# EasyEDA Pro project LedKeychainATtiny2313.eprj

# Schematic Schematic1
Board Name: Board1; Create Date: 2025-04-13; Page Name: P1; Project Name: LedKeychainATtiny2313; Schematic Name: Schematic1; Update Date: 2025-08-21; Company: m039; Drawn: Dmitry Mozgin; Page Size: A4; Version: V1.0
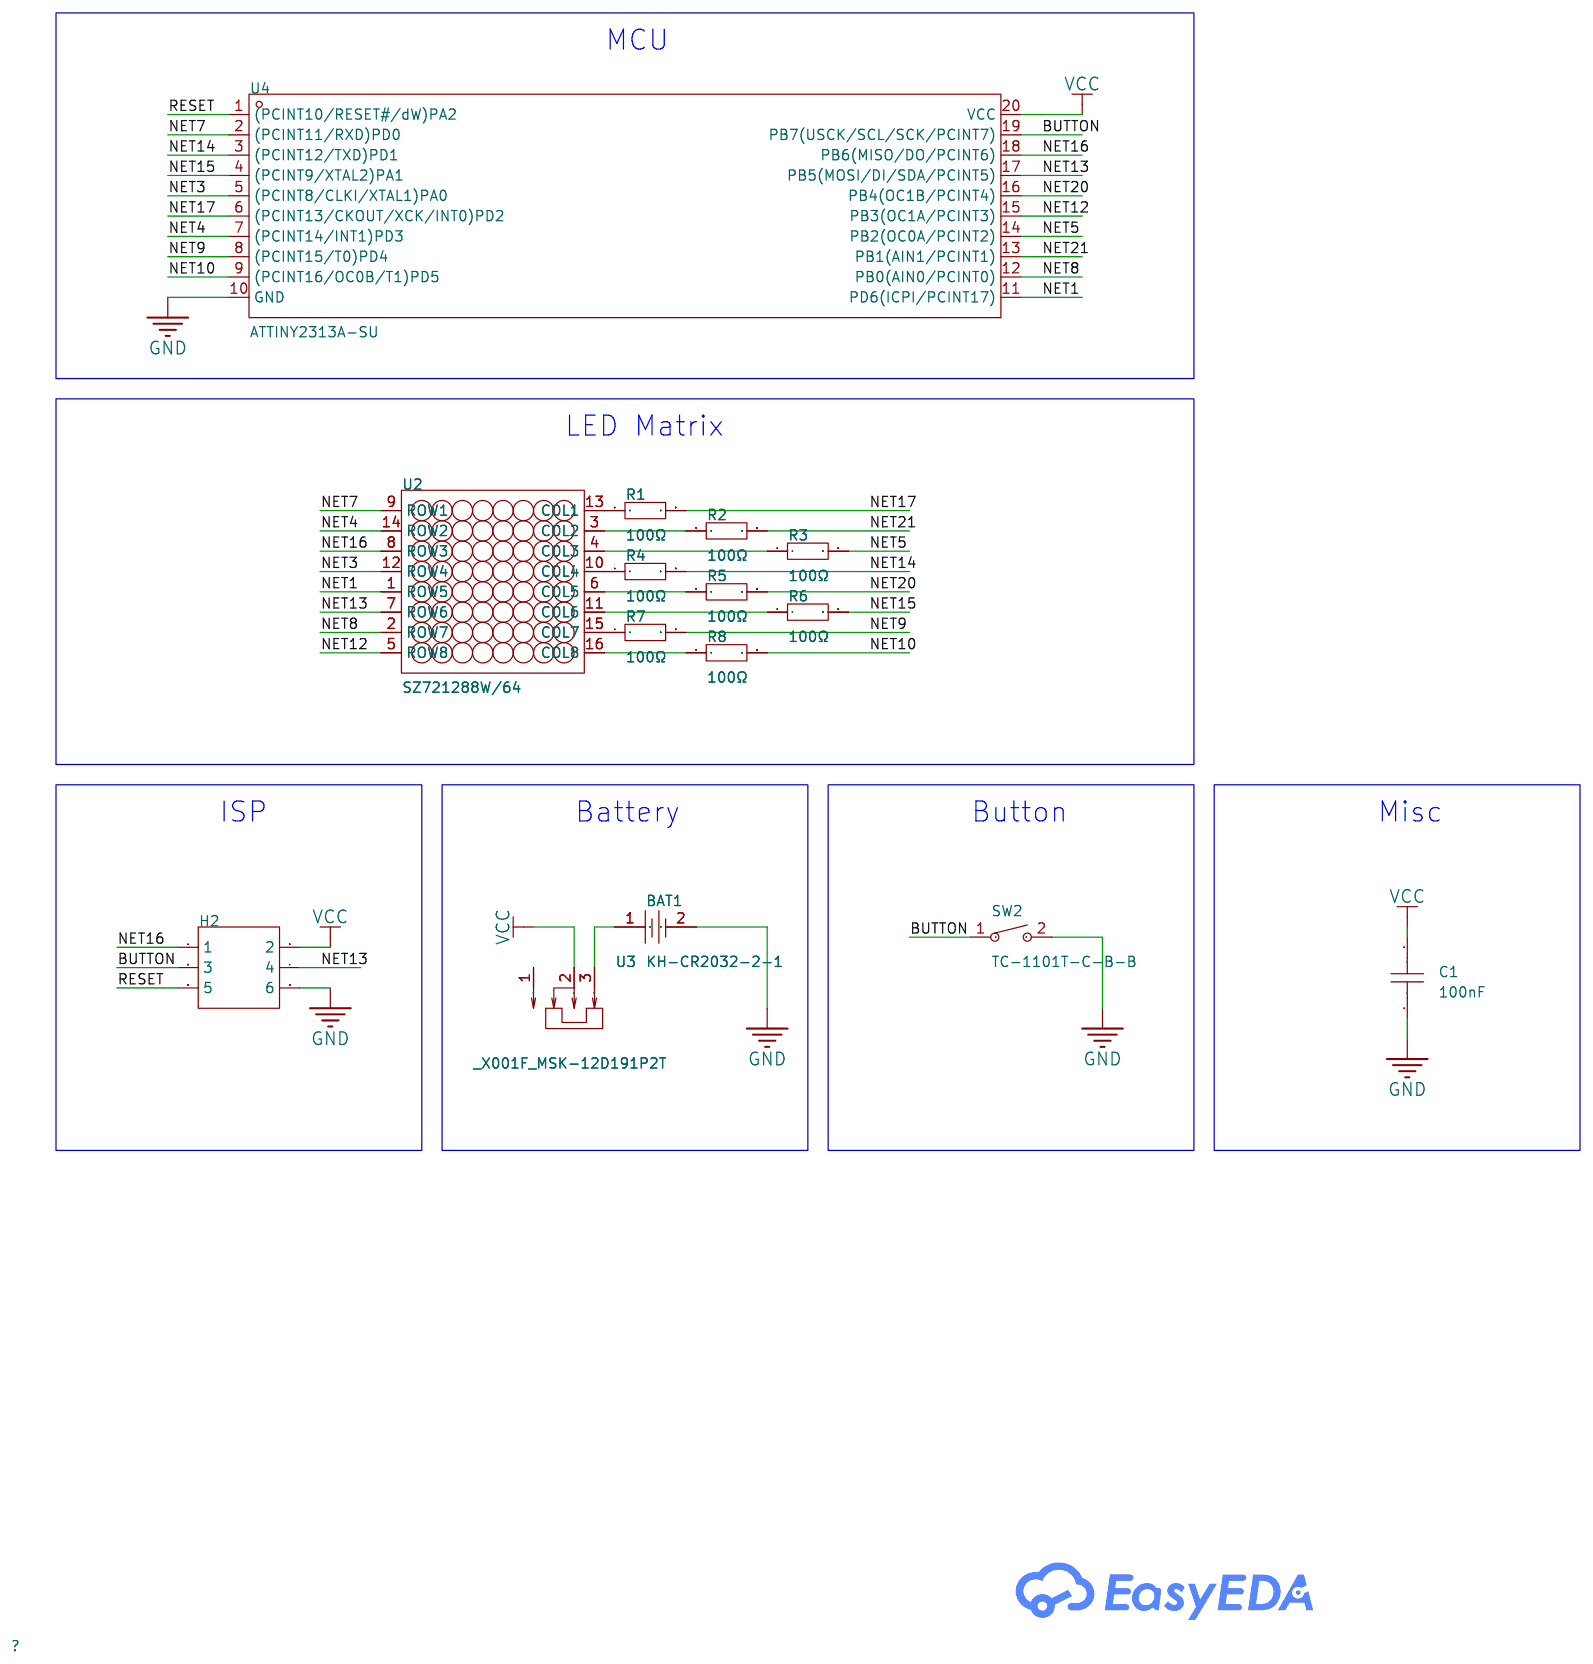
[diagram p0: schematic sheet]

## Parts
BAT1  KH-CR2032-2-1  [BAT-TH_KH-CR2032-2-1]
C1  100nF  [C0805]
H2  -  [HDR-TH_6P-P2.54-V-R2-C3-S2.54_A2541WV-2X3P]
R1  100Ω  [R0805]
R2  100Ω  [R0805]
R3  100Ω  [R0805]
R4  100Ω  [R0805]
R5  100Ω  [R0805]
R6  100Ω  [R0805]
R7  100Ω  [R0805]
R8  100Ω  [R0805]
SW2  TC-1101T-C-B-B  [KEY-TH_2P-L6.0-W3.5-P6.50]
U2  SZ721288W/64  [LED-SEG-TH_SZ421288N-64]
U3  _X001F_MSK-12D191P2T  [SW-TH_MSK-12D191P2T]
U4  ATTINY2313A-SU  [SOIC-20_L13.0-W7.6-P1.27-LS10.3-BL]

## Library data of the parts
BAT1 = KH-CR2032-2-1: Supplier Part: C5365915; Manufacturer: kinghelm(金航标); JLCPCB Part Class: Extended Part; Datasheet: https://atta.szlcsc.com/upload/public/pdf/source/20230301/F3ED62C53898C1F99BC47B7A2E148BA2.pdf; Supplier: LCSC
C1 = CAP_0805: Supplier Footprint: 0805
H2 = HDR-M_2.54_2x3: Supplier Footprint: Through
R1-R8 = 0805W8F1002T5E: LCSC Part Name: 10kΩ ±1% 125mW 厚膜电阻; Supplier Part: C17414; Manufacturer: UNI-ROYAL(厚声); Supplier Footprint: 0805; JLCPCB Part Class: Basic Part; Datasheet: https://atta.szlcsc.com/upload/public/pdf/source/20200306/C422600_1E6D84923E4A46A82E41ADD87F860B5C.pdf; Supplier: LCSC; Type: Thick Film Resistors; Tolerance: ±1%; Temperature Coefficient: ±100ppm/℃; Operating Temperature Range: -55℃~+155℃
SW2 = TC-1101T-C-B-B: LCSC Part Name: 6*3.5*5mm 直插 轻触开关; Supplier Part: C500068; Manufacturer: XKB Connectivity(中国星坤); Supplier Footprint: 插件; JLCPCB Part Class: Extended Part; Datasheet: https://atta.szlcsc.com/upload/public/pdf/source/20211011/B69A8CD93B4DADD1FF98516D35420DE2.pdf; Supplier: LCSC; Circuit: SPST; Actuator Style: Rectangle button; Operating Force: 260gf; Mounting Style: Straight; Switch Length: 6mm; Switch Width: 3.5mm; Switch Height: 5mm; Strike Gundam: 不带; Contact Current: 50mA; Voltage Rating (DC): 12V; Actuator/Cap Color: Black; With Lamp: No; Pin Style: PCPin; Mechanical Life: 5万次; Operating Temperature: -20℃~+70℃
U2 = SZ721288W/64: LCSC Part Name: 8x8位共阴极白色LED点阵; Supplier Part: C2980924; Manufacturer: ARKLED(方舟); Supplier Footprint: 插件; JLCPCB Part Class: Extended Part; Datasheet: https://atta.szlcsc.com/upload/public/pdf/source/20220310/02C92D6EC4802147600AB7D5BBA1ACF2.pdf; Supplier: LCSC; Dot Matrix Number: 8x8; Emitting Color: White; Polarity: Common Cathode
U3 = MSK-12D19: Supplier: LCSC; Supplier Part: C9900016029; Manufacturer: null; Manufacturer Part: _x001F_MSK-12D191P2T; JLCPCB Part Class: Extended Part
U4 = ATTINY2313A-SU: Supplier Part: C424094; Manufacturer: MICROCHIP(美国微芯); Supplier Footprint: SOIC-20-300mil; JLCPCB Part Class: Extended Part; Datasheet: https://item.szlcsc.com/datasheet/ATTINY2313A-SU/417117.html; Supplier: LCSC; CPU Core: AVR; CPU Maximum Speed: 20MHz; Program Storage Size: 1KB; Program Memory Type: FLASH; Number of I/O: 18; Voltage - Supply: 1.8V~5.5V

## Nets
GND: BAT1.2 C1.1 H2.6 SW2.2 U4.10(GND)
VCC: C1.2 H2.2 U3.2 U4.20(VCC)
BUTTON: H2.3 SW2.1 U4.19(PB7(USCK/SCL/SCK/PCINT7))
NET1: U2.1(ROW5) U4.11(PD6(ICPI/PCINT17))
NET3: U2.12(ROW4) U4.5((PCINT8/CLKI/XTAL1)PA0)
NET4: U2.14(ROW2) U4.7((PCINT14/INT1)PD3)
NET5: R3.2 U4.14(PB2(OC0A/PCINT2))
NET7: U2.9(ROW1) U4.2((PCINT11/RXD)PD0)
NET8: U2.2(ROW7) U4.12(PB0(AIN0/PCINT0))
NET9: R7.2 U4.8((PCINT15/T0)PD4)
NET10: R8.2 U4.9((PCINT16/OC0B/T1)PD5)
NET12: U2.5(ROW8) U4.15(PB3(OC1A/PCINT3))
NET13: H2.4 U2.7(ROW6) U4.17(PB5(MOSI/DI/SDA/PCINT5))
NET14: R4.2 U4.3((PCINT12/TXD)PD1)
NET15: R6.2 U4.4((PCINT9/XTAL2)PA1)
NET16: H2.1 U2.8(ROW3) U4.18(PB6(MISO/DO/PCINT6))
NET17: R1.2 U4.6((PCINT13/CKOUT/XCK/INT0)PD2)
NET20: R5.2 U4.16(PB4(OC1B/PCINT4))
NET21: R2.2 U4.13(PB1(AIN1/PCINT1))
RESET: H2.5 U4.1((PCINT10/RESET#/dW)PA2)
$1N1721: R2.1 U2.3(COL2)
$1N1762: R3.1 U2.4(COL3)
$1N1803: R4.1 U2.10(COL4)
$1N1844: R5.1 U2.6(COL5)
$1N1883: R6.1 U2.11(COL6)
$1N1963: R8.1 U2.16(COL8)
$1N1971: R1.1 U2.13(COL1)
$1N1973: R7.1 U2.15(COL7)
$1N4267: BAT1.1 U3.3

Not connected (* = marked no-connect by the designer): U3 1

## Notes on the sheet
- MCU
- LED Matrix
- ISP
- Battery
- Button
- Misc

# Board PCB1
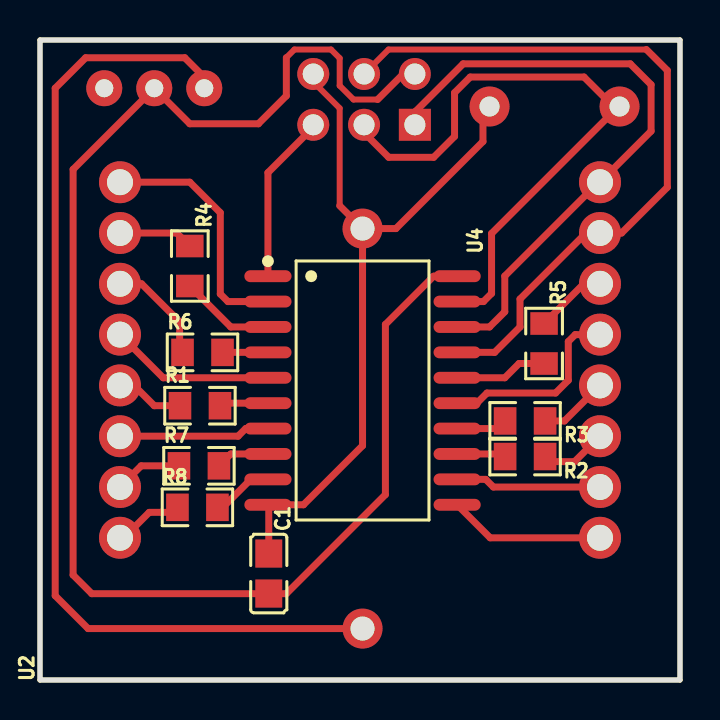
[diagram p1: board, top side]
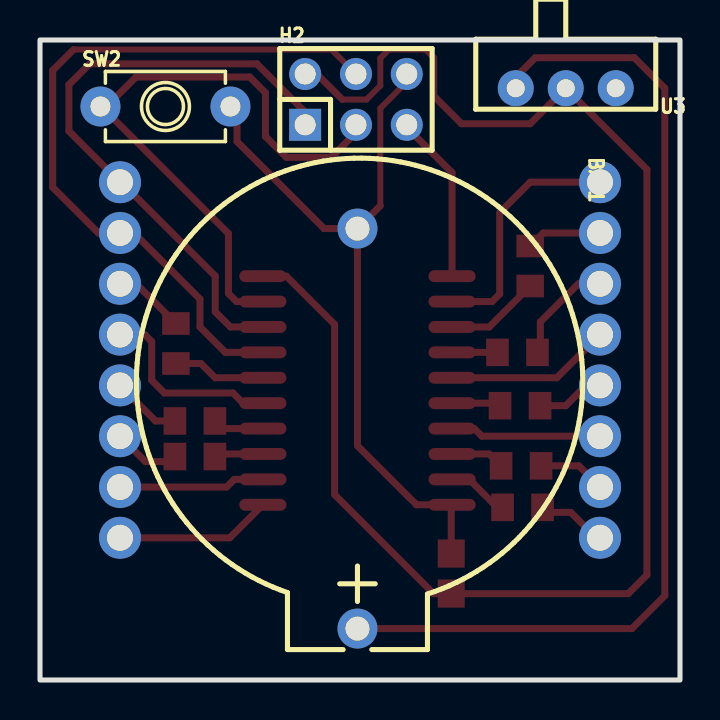
[diagram p2: board, bottom side, seen from below]

Outline 32 x 32 mm; copper layers: Top Layer, Bottom Layer. Coordinates in mm from the lower left corner of the outline.
Outline path: rectangle 0,32 32,0
Stack: Top Layer 0.035mm / Dielectric1 1.51mm FR4 er 4.5 / Bottom Layer 0.035mm

## Design rules (mm)
template: Custom Config
spacing copperThickness1oz (default): track to track 0.102, other pairs 0.152 to 0.3
spacing copperThickness2oz: track to track 0.203, other pairs 0.152 to 0.3
track width copperThickness1oz (default): min 0.127, default 0.35, max 2.54
track width copperThickness2oz: min 0.203, default 0.254, max 2.54
differential pair differentialPair (default): width min 0.127, default 0.254, max 2.54; gap min 0.152, default 0.152
via viaSize (default): diameter min 0.5, default 0.61, max 10; hole min 0.3, default 0.305, max 6.3

## Placement (name value [footprint] x y rotation side)
BAT1  KH-CR2032-2-1  [BAT-TH_KH-CR2032-2-1]  16.13 12.57 270 bottom
C1  100nF  [C0805]  11.44 5.32 270 top
H2  -  [HDR-TH_6P-P2.54-V-R2-C3-S2.54_A2541WV-2X3P]  16.2 29.03 180 bottom
R1  100Ω  [R0805]  8 13.71 0 top
R2  100Ω  [R0805]  24.25 11.17 180 top
R3  100Ω  [R0805]  24.25 12.95 180 top
R4  100Ω  [R0805]  7.49 20.7 270 top
R5  100Ω  [R0805]  25.2 16.82 270 top
R6  100Ω  [R0805]  8.13 16.38 0 top
R7  100Ω  [R0805]  7.95 10.71 0 top
R8  100Ω  [R0805]  7.87 8.63 0 top
SW2  TC-1101T-C-B-B  [KEY-TH_2P-L6.0-W3.5-P6.50]  25.73 28.67 180 bottom
U2  SZ721288W/64  [LED-SEG-TH_SZ421288N-64]  16 16 90 top
U3  _X001F_MSK-12D191P2T  [SW-TH_MSK-12D191P2T]  5.71 29.59 0 bottom
U4  ATTINY2313A-SU  [SOIC-20_L13.0-W7.6-P1.27-LS10.3-BL]  16.13 14.48 270 top

## Footprints (pads in the part's own frame, mm; a bottom-side part is the same pattern mirrored in y, then rotated)
BAT-TH_KH-CR2032-2-1
  round 2 hole 1.2x0.9: 1(10,0) 2(-10,0)
C0805
  rect 1.41x1.35 smd: 1(-1,0) 2(1,0)
HDR-TH_6P-P2.54-V-R2-C3-S2.54_A2541WV-2X3P
  rect 1.6x1.6 hole 1.05x0.8: 1(-2.54,-1.27)
  round 1.6 hole 1.05x0.8: 2(-2.54,1.27) 3(0,-1.27) 4(0,1.27) 5(2.54,-1.27) 6(2.54,1.27)
KEY-TH_2P-L6.0-W3.5-P6.50
  round 2 hole 1: 1(-3.25,0) 2(3.25,0)
LED-SEG-TH_SZ421288N-64
  round 2.1 hole 1.3: 1(-8.89,-12) 2(-6.35,-12) 3(-3.81,-12) 4(-1.27,-12) 5(1.27,-12) 6(3.81,-12) 7(6.35,-12) 8(8.89,-12) 9(8.89,12) 10(6.35,12) 11(3.81,12) 12(1.27,12) 13(-1.27,12) 14(-3.81,12) 15(-6.35,12) 16(-8.89,12)
R0805
  rect 1.133x1.377 smd: 1(-1,0) 2(1,0)
SOIC-20_L13.0-W7.6-P1.27-LS10.3-BL
  oval 0.595x2.36 smd: 1(-5.715,-4.73) 2(-4.445,-4.73) 3(-3.175,-4.73) 4(-1.905,-4.73) 5(-0.635,-4.73) 6(0.635,-4.73) 7(1.905,-4.73) 8(3.175,-4.73) 9(4.445,-4.73) 10(5.715,-4.73) 11(5.715,4.73) 12(4.445,4.73) 13(3.175,4.73) 14(1.905,4.73) 15(0.635,4.73) 16(-0.635,4.73) 17(-1.905,4.73) 18(-3.175,4.73) 19(-4.445,4.73) 20(-5.715,4.73)
SW-TH_MSK-12D191P2T
  round 1.8 hole 0.9x0.8: 1(-2.5,0) 2(0,0) 3(2.5,0)

## Nets
As in the schematic.

Pads without a net: U3 1

## Routing (per net, layer and track width the routed paths; a pad name or vN(x,y) marks a point on that pad's centre or on a via; arc(x,y) is an arc through that point)
GND: length 38
  Top Layer w0.3: 13.66,29.91 14.98,28.59 14.98,23.71
  Top Layer w0.35: BAT1.2 14.98,23.71 ; BAT1.2 16.13,11.71 13.17,8.76 U4.10 11.44,8.72 C1.1 ; BAT1.2 17.8,22.57 22.15,26.92 22.15,28.5 22.57,28.92 ; 13.66,29.91 H2.6
VCC: length 76
  Top Layer w0.3: 16.88,29.02 15.68,29.02 14.98,29.72 14.98,31.09 14.55,31.53 12.72,31.53 12.32,31.12
  Top Layer w0.35: U4.20 19.68,20.19 17.27,17.78 17.27,9.27 12.32,4.32 2.59,4.32 1.66,5.25 1.66,25.53 U3.2 7.49,27.81 10.92,27.81 12.32,29.21 12.32,31.12 ; 18.79,30.35 18.21,30.35 16.88,29.02
BUTTON: length 30.6
  Top Layer w0.35: H2.3 16.2,27.37 17.44,26.13 19.68,26.13 20.73,27.18 20.73,29.36 21.51,30.15 27.2,30.15 28.55,28.79 28.55,28.3 22.58,22.32 22.58,19.33 22.17,18.92 U4.19
NET1: length 7.8
  Top Layer w0.35: U4.11 22.51,7.11 U2.1
NET3: length 8.3
  Top Layer w0.35: U2.12 6.16,15.11 U4.5
NET4: length 7.6
  Top Layer w0.35: U2.14 9.9,12.19 10.28,12.57 U4.7
NET5: length 2.6
  Top Layer w0.35: R3.2 22.87,12.57 U4.14
NET7: length 12.3
  Top Layer w0.35: U4.2 9.4,18.92 9.01,19.3 9.01,23.37 7.49,24.89 U2.9
NET8: length 7.3
  Top Layer w0.35: U2.2 22.67,9.65 22.29,10.03 U4.12
NET9: length 2.7
  Top Layer w0.35: U4.8 9.54,11.3 R7.2
NET10: length 3.1
  Top Layer w0.35: U4.9 10.54,10.03 9.14,8.63 R8.2
NET12: length 9.7
  Top Layer w0.35: U4.15 21.84,13.84 22.35,14.35 25.78,14.35 26.41,14.98 26.41,16.92 26.76,17.27 U2.5
NET13: length 36.6
  Top Layer w0.3: 16.25,30.35 17.43,31.53 30.32,31.53
  Top Layer w0.35: U4.17 22.73,16.38 24,17.65 24,19.05 27.3,22.35 U2.7 29.08,22.35 31.37,24.64 31.37,30.48 30.32,31.53
NET14: length 4.8
  Top Layer w0.35: U4.3 9.54,17.65 R4.2
NET15: length 2.3
  Top Layer w0.35: U4.4 R6.2
NET16: length 30.9
  Top Layer w0.35: 18.79,27.81 18.79,28.45 21.16,30.81 29.51,30.81 30.55,29.77 30.55,27.44 U2.8 27.93,24.89 23.24,20.2 23.24,18.41 22.48,17.65 U4.18
NET17: length 2.5
  Top Layer w0.35: R1.2 9.13,13.84 U4.6
NET20: length 4.6
  Top Layer w0.35: R5.2 23.95,15.82 23.24,15.11 U4.16
NET21: length 2.7
  Top Layer w0.35: U4.13 23.11,11.3 23.25,11.16 23.25,10.92
RESET: length 8.5
  Top Layer w0.35: U4.1 11.4,25.37 13.66,27.63 H2.5
$1N1721: length 3.3
  Top Layer w0.35: U2.3 26.73,10.92 25.25,10.92
$1N1762: length 3.5
  Top Layer w0.35: R3.1 26.22,12.95 U2.4
$1N1803: length 3.8
  Top Layer w0.35: U2.10 6.84,22.35 R4.1
$1N1844: length 3.6
  Top Layer w0.35: U2.6 27.19,19.81 R5.1
$1N1883: length 5.4
  Top Layer w0.35: U2.11 5.08,19.81 6.98,17.91 6.98,16.52 R6.1
$1N1963: length 3.5
  Top Layer w0.35: R8.1 6.62,8.38 5.46,8.38 4.19,7.11 U2.16
$1N1971: length 3.4
  Top Layer w0.35: U2.13 4.7,14.73 5.71,13.71 R1.1
$1N1973: length 3.4
  Top Layer w0.35: R7.1 5.06,10.71 U2.15
$1N4267: length 50.5
  Top Layer w0.35: BAT1.1 2.4,2.57 0.76,4.21 0.76,29.59 2.28,31.11 7.24,31.11 8.21,30.14 U3.3
